# EAGLE design Pressure_nopins (EAGLE 9.6.2)
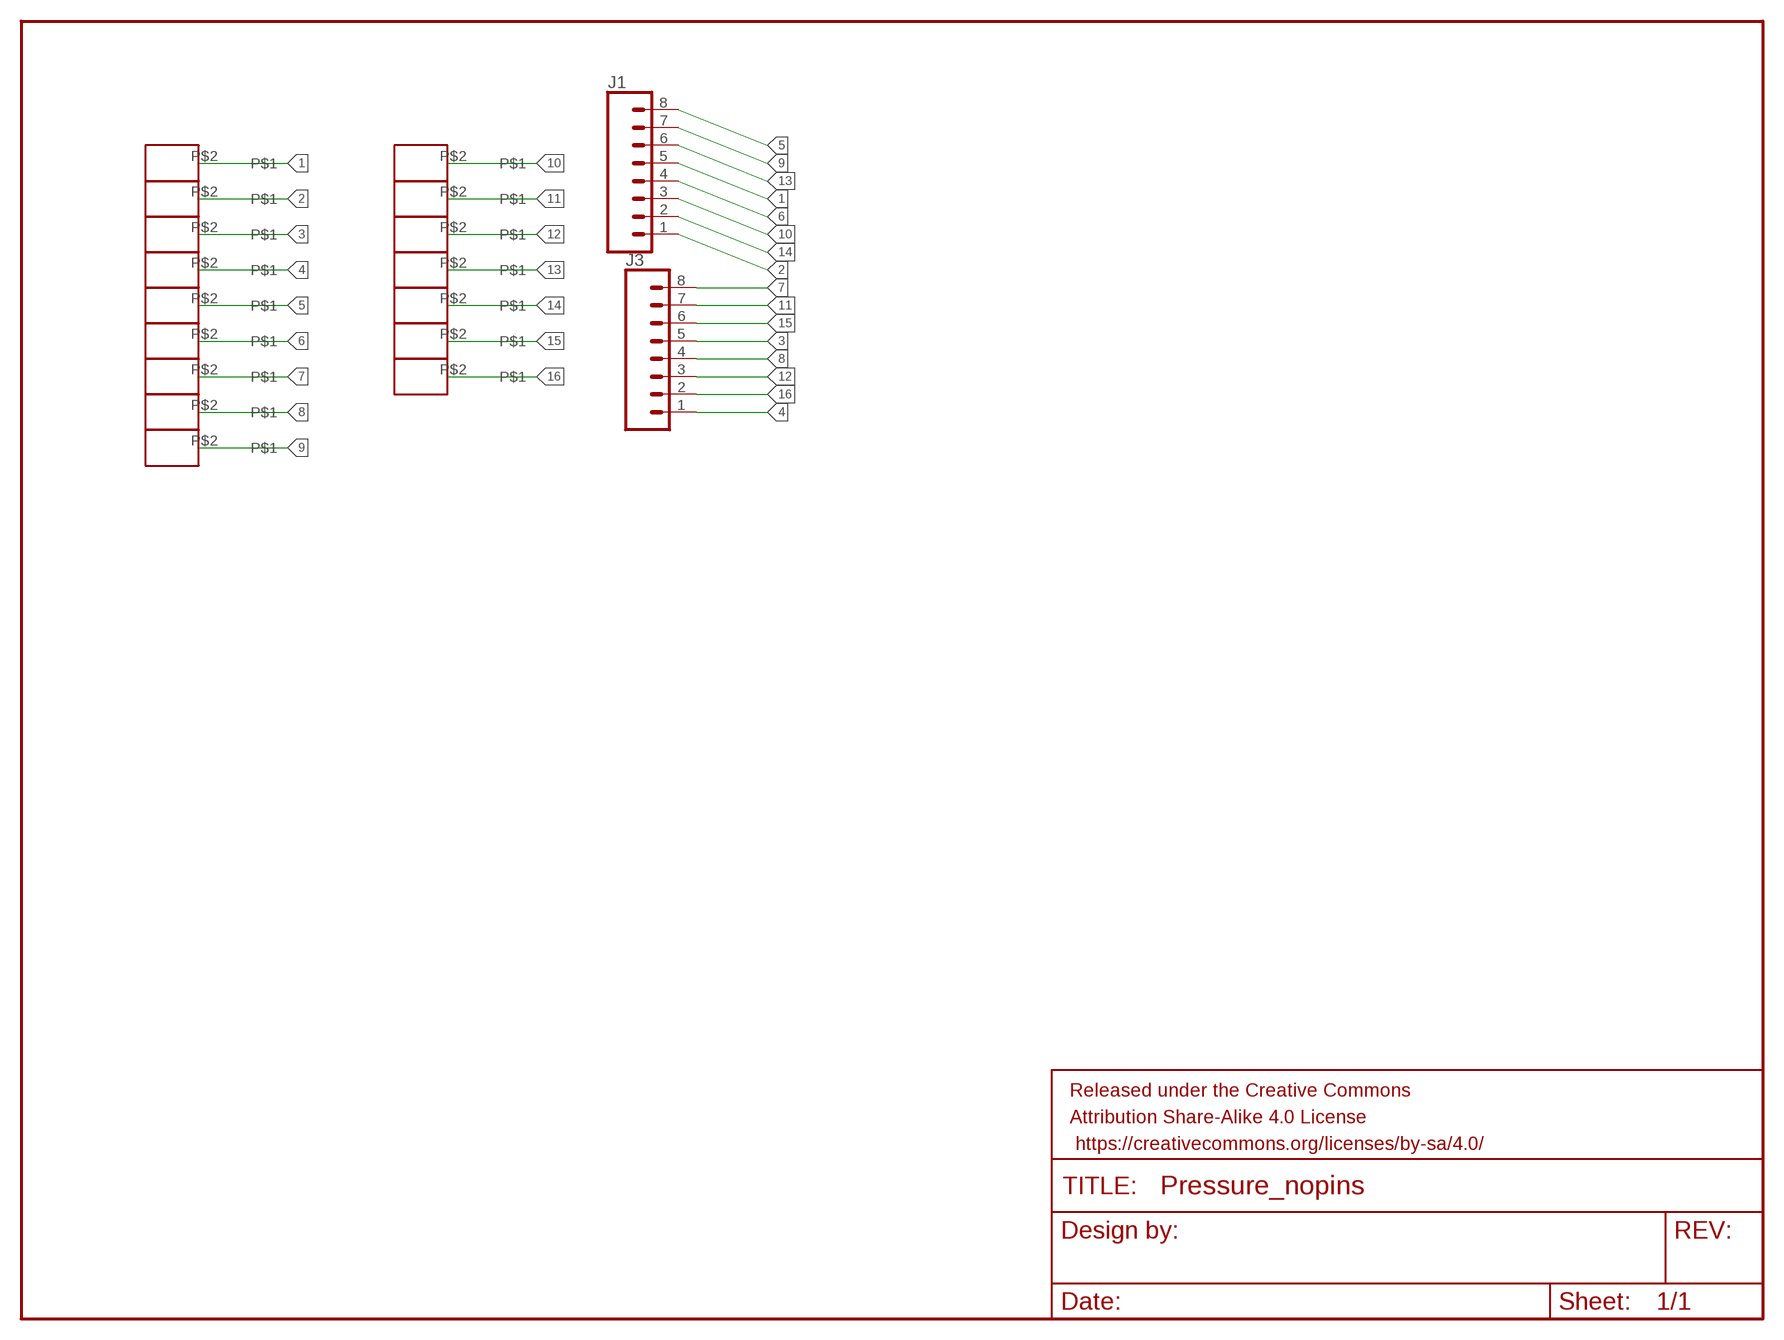
[diagram p0: schematic, sheet 1]

## Parts
FRAME1  FRAME-LETTERNO_PACKAGE  [DUMMY]
J1  CONN_08SMD-MALE  [1X08_SMD_MALE]
J3  CONN_08SMD-MALE  [1X08_SMD_MALE]
U$1  250MIL_1X1  [250MIL_1X1]
U$2  250MIL_1X1  [250MIL_1X1]
U$3  250MIL_1X1  [250MIL_1X1]
U$4  250MIL_1X1  [250MIL_1X1]
U$5  250MIL_1X1  [250MIL_1X1]
U$6  250MIL_1X1  [250MIL_1X1]
U$7  250MIL_1X1  [250MIL_1X1]
U$8  250MIL_1X1  [250MIL_1X1]
U$9  250MIL_1X1  [250MIL_1X1]
U$10  250MIL_1X1  [250MIL_1X1]
U$11  250MIL_1X1  [250MIL_1X1]
U$12  250MIL_1X1  [250MIL_1X1]
U$13  250MIL_1X1  [250MIL_1X1]
U$14  250MIL_1X1  [250MIL_1X1]
U$15  250MIL_1X1  [250MIL_1X1]
U$16  250MIL_1X1  [250MIL_1X1]

## Nets
1: J1.5 U$1.P$2
2: J1.1 U$2.P$2
3: J3.5 U$3.P$2
4: J3.1 U$4.P$2
5: J1.8 U$5.P$2
6: J1.4 U$6.P$2
7: J3.8 U$7.P$2
8: J3.4 U$8.P$2
9: J1.7 U$9.P$2
10: J1.3 U$10.P$2
11: J3.7 U$11.P$2
12: J3.3 U$12.P$2
13: J1.6 U$13.P$2
14: J1.2 U$14.P$2
15: J3.6 U$15.P$2
16: J3.2 U$16.P$2

## Library data of the parts
FRAME1 = SparkFun-Aesthetics:FRAME-LETTER: Schematic Frame - Letter Standard 8.5x11 US Letter frame; DESIGNER: Nobody; VERSION: v01
J1 J3 = SparkFun-Connectors:CONN_08: Multi connection point. Often used as Generic Header-pin footprint for 0.1 inch spaced/style header connections On any of the 0.1 inch spaced packages, you can populate with these: Break Away Headers - Straight <https://www.sparkfun.com/products/116> (PRT-00116) Break Away Male Headers - Right Angle <https://www.sparkfun.com/products/553> (PRT-00553) Female Headers <https://www.sparkfun.com/products/115> (PRT-00115) Break Away Headers - Machine Pin <https://www.sparkfun.com/products/117> (PRT-00117) Break Away Female Headers - Swiss Machine Pin <https://www.sparkfun.com/products/743> (PRT-00743) Arduino Stackable Header - 8 Pin <https://www.sparkfun.com/products/9279> (PRT-09279) For SCREWTERMINALS and SPRING TERMINALS visit here: Screw Terimnals on SparkFun.com <https://www.sparkfun.com/search/results?term=Screw+Terminals> (5mm/3.5mm/2.54mm spacing) This device is also useful as a general connection point to wire up your design to another part of your project. Our various solder wires solder well into these plated through hole pads. Hook-Up Wire - Assortment (Stranded, 22 AWG) <https://www.sparkfun.com/products/11375> (PRT-11375) Hook-Up Wire - Assortment (Solid Core, 22 AWG) <https://www.sparkfun.com/products/11367> (PRT-11367) View the entire wire category on our website here <https://www.sparkfun.com/categories/141> Special notes: Molex polarized connector foot print use with SKU : PRT-08231 with associated crimp pins and housings. 1MM SMD Version SKU: PRT-10208 NOTES ON THE VARIANTS LOCK and LOCK_LONGPADS... This footprint was designed to help hold the alignment of a through-hole component (i.e. 6-pin header) while soldering it into place. You may notice that each hole has been shifted either up or down by 0.005 of an inch from it's more standard position (which is a perfectly straight line). This slight alteration caused the pins (the squares in the middle) to touch the edges of the holes. Because they are alternating, it causes a "brace" to hold the component in place. 0.005 has proven to be the perfect amount of "off-center" position when using our standard breakaway headers. Although looks a little odd when you look at the bare footprint, once you have a header in there, the alteration is very hard to notice. Also,if you push a header all the way into place, it is covered up entirely on the bottom side.; PROD_ID: CONN-11292; SF_ID: PRT-11541
U$1-U$16 = connectors:250MIL_1X1

## Board
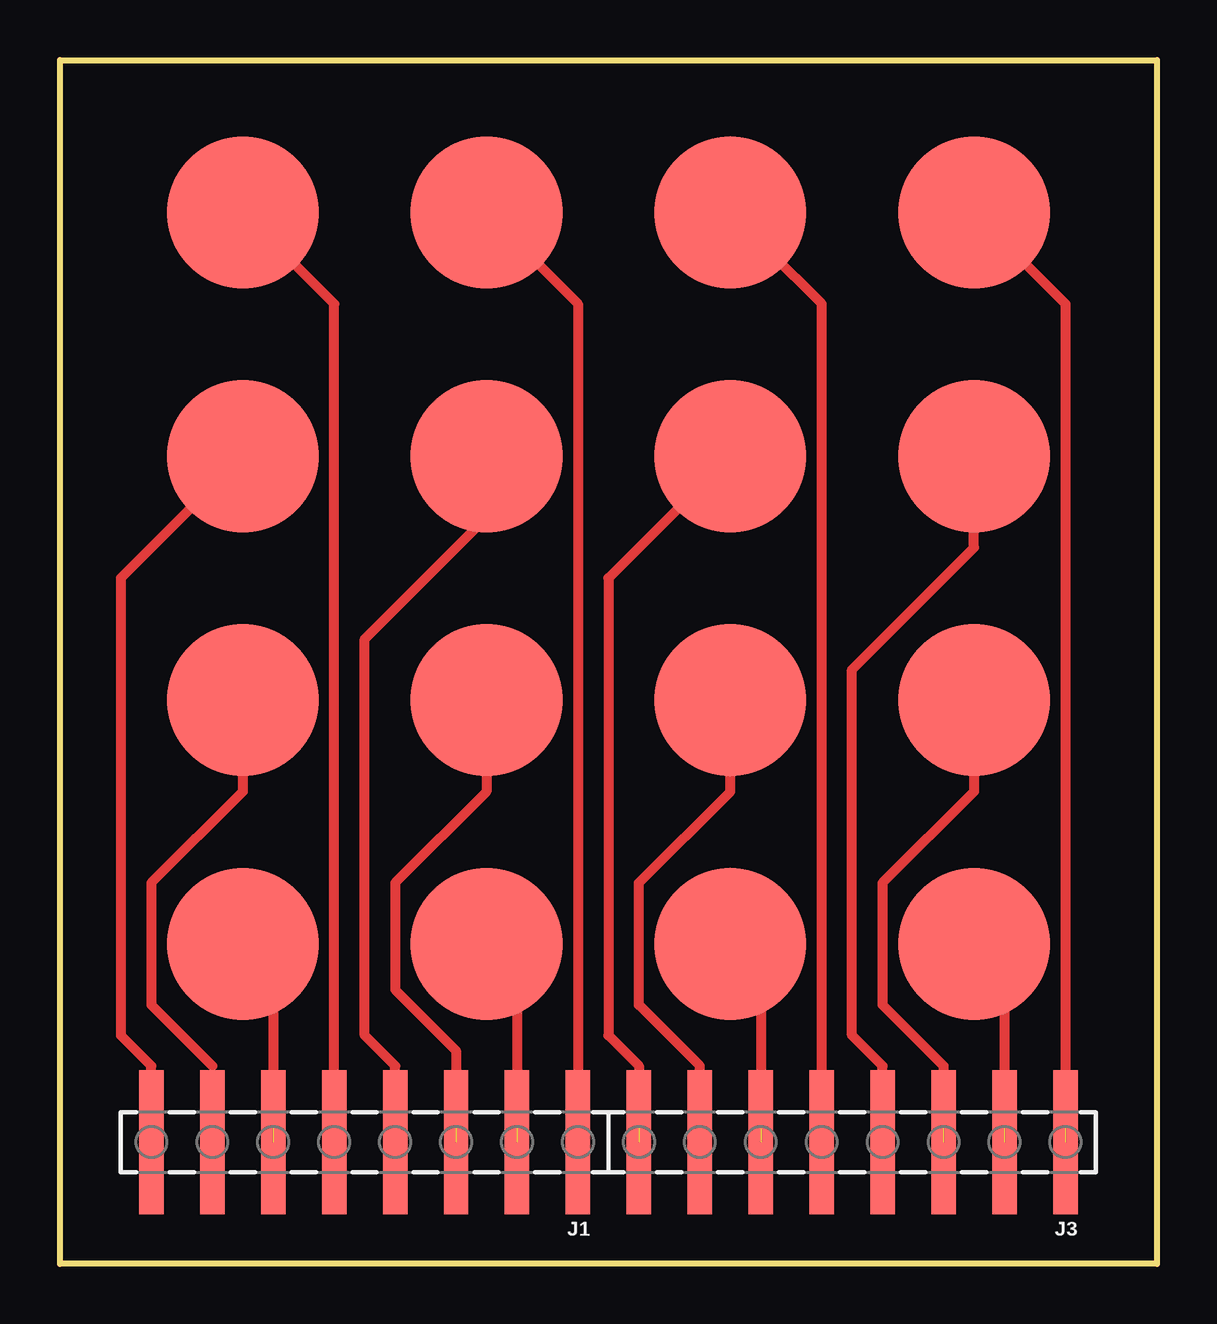
[diagram p1: board, top side]

Size 45.72 x 50.16 mm. Coordinates in mm from the lower left corner, seen from the top.
Outline: 0,0 0,50.16 45.72,50.16 45.72,0 0,0
Copper layers (1*16): Top 0.035mm / dielectric 1.5mm / Bottom 0.035mm
Design rules "default": minimum track width 6mil, minimum drill 0.35mm, track to track 6mil, track to pad 6mil, pad to pad 6mil, via to via 6mil, smd to smd 6mil, copper to edge 40mil, drill to drill 6mil, minimum pad ring 10mil, minimum via ring 8mil, stop-mask expansion 4mil, vias tented up to drill 0mil, thermal gap 10mil

### Footprints (pad centres in the part's own frame; a part is rotated, then mirrored left to right if it is on the bottom)
1X08_SMD_MALE = smd 1.02 x 6: 1 0,0; 2 2.54,0; 3 5.08,0; 4 7.62,0; 5 10.16,0; 6 12.7,0; 7 15.24,0; 8 17.78,0
250MIL_1X1 = smd 6.35 x 6.35: P$2 0,0

### Placement (x,y rotation side)
FRAME1  105.41,-35.56 0 top  (outside the outline)
J1  21.59,5.08 180 top
J3  41.91,5.08 180 top
U$1  7.62,43.81 0 top
U$2  17.78,43.81 0 top
U$3  27.94,43.81 0 top
U$4  38.1,43.81 0 top
U$5  7.62,33.66 0 top
U$6  17.78,33.66 0 top
U$7  27.94,33.66 0 top
U$8  38.1,33.66 0 top
U$9  7.62,23.5 0 top
U$10  17.78,23.5 0 top
U$11  27.94,23.5 0 top
U$12  38.1,23.5 0 top
U$13  7.62,13.34 0 top
U$14  17.78,13.34 0 top
U$15  27.94,13.34 0 top
U$16  38.1,13.34 0 top

### Tracks (layer width: path | path; a pad name or v marks a point on that pad's centre or on a via)
1
  Top 0.254: 8.26,43.18 U$1.P$2 | 11.43,40.01 11.43,5.71
  Top 0.406: J1.5 11.43,40.01 8.26,43.18
2
  Top 0.254: 21.59,40.01 21.59,5.71
  Top 0.406: U$2.P$2 21.59,40.01 J1.1
3
  Top 0.254: 29.53,42.23 U$3.P$2 | 31.75,40.01 31.75,5.71
  Top 0.406: J3.5 31.75,40.01 29.53,42.23
4  (1 unrouted)
  Top 0.406: U$4.P$2 41.91,40.01 41.91,5.71
5
  Top 0.254: 3.81,8.26 3.81,7.62 3.81,6.35 3.81,5.71
  Top 0.406: U$5.P$2 2.54,28.57 2.54,9.53 3.81,8.26 J1.8 | J1.8 3.81,6.35 | J1.8 3.81,7.62
6
  Top 0.254: 17.78,31.11 U$6.P$2 | 13.97,8.26 13.97,5.71
  Top 0.406: J1.4 13.97,8.26 12.7,9.53 12.7,26.04 17.78,31.11
7  (1 unrouted)
  Top 0.254: 24.13,6.99 24.13,5.71
  Top 0.406: U$7.P$2 22.86,28.57 22.86,9.53 24.13,8.26 24.13,6.99
8
  Top 0.254: 38.1,31.11 U$8.P$2 | 34.29,8.26 34.29,5.71
  Top 0.406: J3.4 34.29,8.26 33.02,9.53 33.02,24.77 38.1,29.84 38.1,31.11
9
  Top 0.254: 6.35,8.26 6.35,6.99 6.35,5.71
  Top 0.406: U$9.P$2 7.62,19.68 3.81,15.88 3.81,10.79 6.35,8.26 | J1.7 6.35,6.99
10  (1 unrouted)
  Top 0.254: 16.51,6.99 16.51,5.71
  Top 0.406: U$10.P$2 17.78,19.68 13.97,15.88 13.97,11.43 16.51,8.89 16.51,6.99
11
  Top 0.254: 27.94,21.59 U$11.P$2 | 26.67,8.26 26.67,5.71
  Top 0.406: J3.7 26.67,8.26 24.13,10.79 24.13,15.88 27.94,19.68 27.94,21.59
12  (1 unrouted)
  Top 0.254: 36.83,6.99 36.83,5.71
  Top 0.406: U$12.P$2 38.1,19.68 34.29,15.88 34.29,10.79 36.83,8.26 36.83,6.99
13  (1 unrouted)
  Top 0.254: 8.89,6.99 8.89,5.71
  Top 0.406: U$13.P$2 8.89,12.06 8.89,6.99
14  (1 unrouted)
  Top 0.254: 19.05,6.99 19.05,5.71
  Top 0.406: U$14.P$2 19.05,12.06 19.05,6.99
15  (1 unrouted)
  Top 0.254: 29.21,6.99 29.21,5.71
  Top 0.406: U$15.P$2 29.21,12.06 29.21,6.99
16  (1 unrouted)
  Top 0.254: 39.37,6.99 39.37,5.71
  Top 0.406: U$16.P$2 39.37,12.06 39.37,6.99